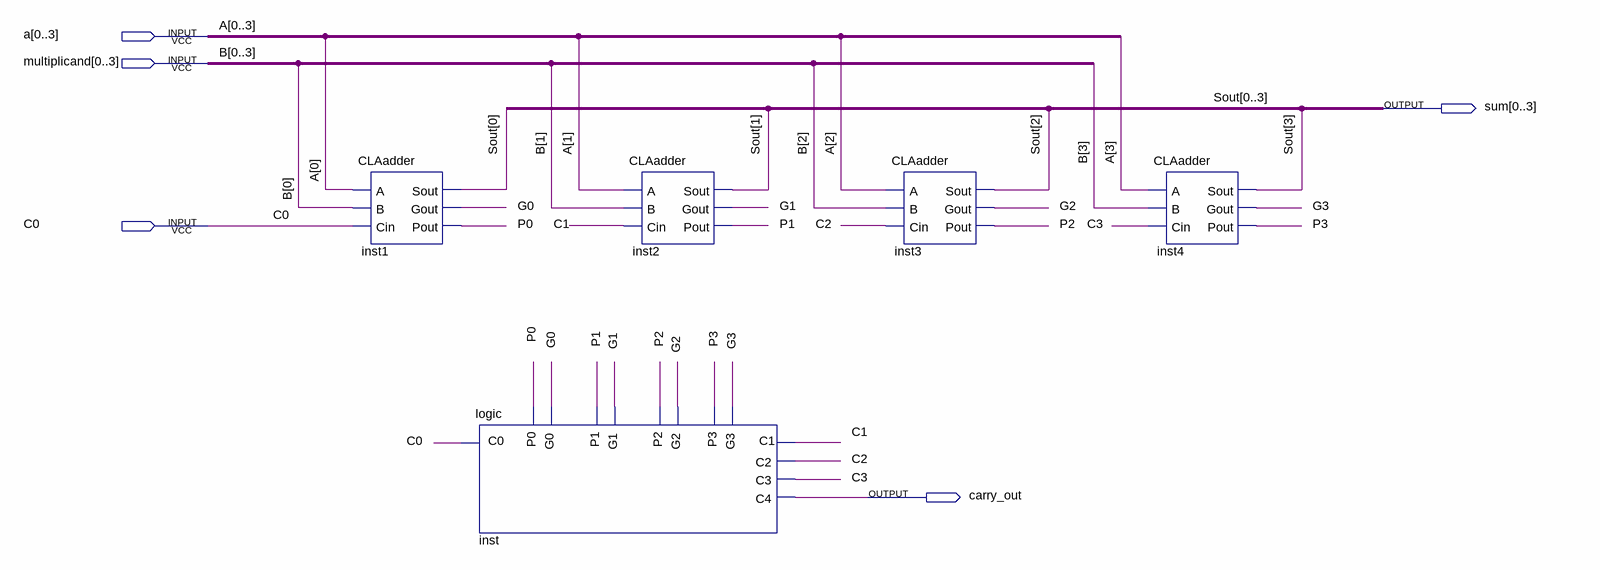
[diagram p0: schematic sheet]
// Quartus schematic adder.bdf as structural Verilog: 5 symbols, 5 pins
module adder (
  input  [0:3] a,
  input  [0:3] multiplicand,
  input  C0,
  output [0:3] sum,
  output carry_out
);

  wire C1, C2, C3, G0, G1, G2, G3, P0, P1, P2, P3;

  CLAadder inst1 (.A(a[0]), .B(multiplicand[0]), .Cin(C0), .Sout(sum[0]), .Gout(G0), .Pout(P0));
  \logic  inst (
    .C0(C0), .P0(P0), .P1(P1), .P2(P2), .P3(P3), .G0(G0), .G1(G1), .G2(G2), .G3(G3), .C1(C1), .C2(C2),
    .C3(C3), .C4(carry_out));
  CLAadder inst2 (.A(a[1]), .B(multiplicand[1]), .Cin(C1), .Sout(sum[1]), .Gout(G1), .Pout(P1));
  CLAadder inst3 (.A(a[2]), .B(multiplicand[2]), .Cin(C2), .Sout(sum[2]), .Gout(G2), .Pout(P2));
  CLAadder inst4 (.A(a[3]), .B(multiplicand[3]), .Cin(C3), .Sout(sum[3]), .Gout(G3), .Pout(P3));

  // Other names for the same wires on the sheet: B[3:0] = {multiplicand[3], multiplicand[2], multiplicand[1], multiplicand[0]};
  //   Sout[3:0] = {sum[3], sum[2], sum[1], sum[0]}
endmodule
